# Altium project Drone.PrjPCB
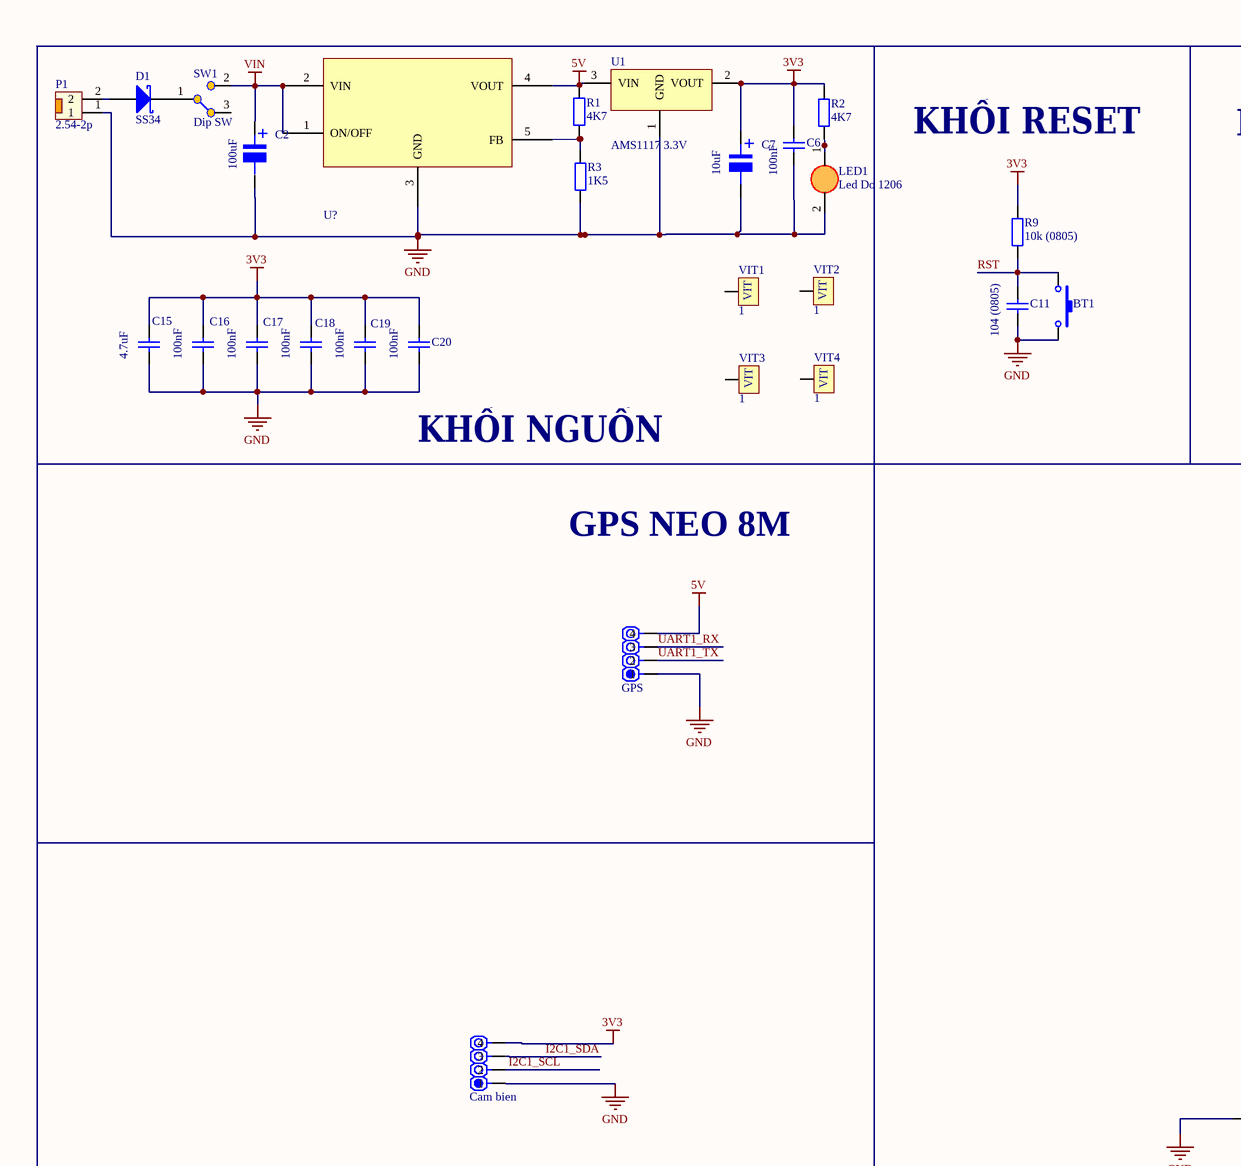
[diagram p0: Drone.SchDoc, top left]
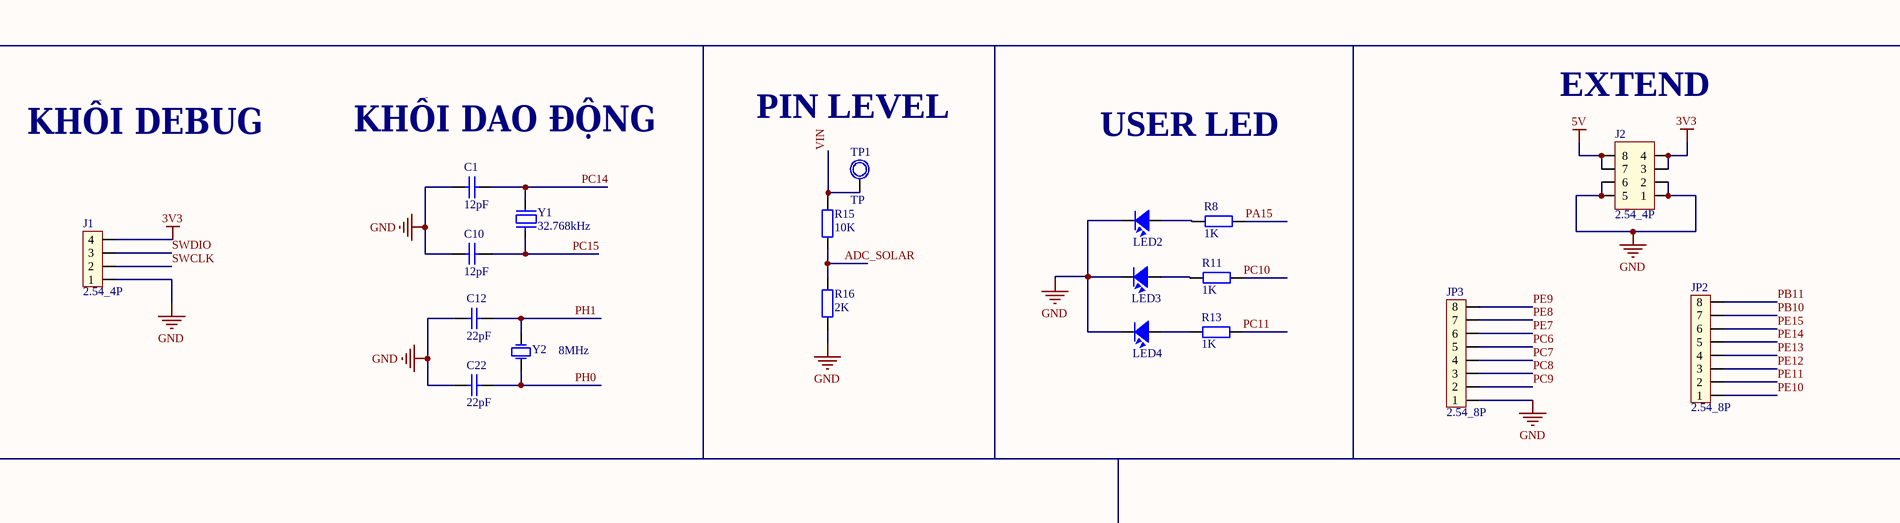
[diagram p1: Drone.SchDoc, top right]
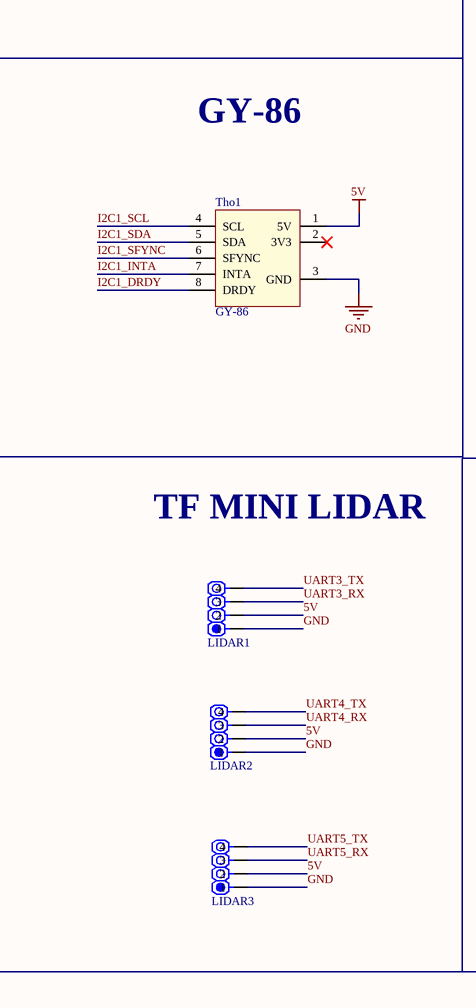
[diagram p2: Drone.SchDoc, bottom left]
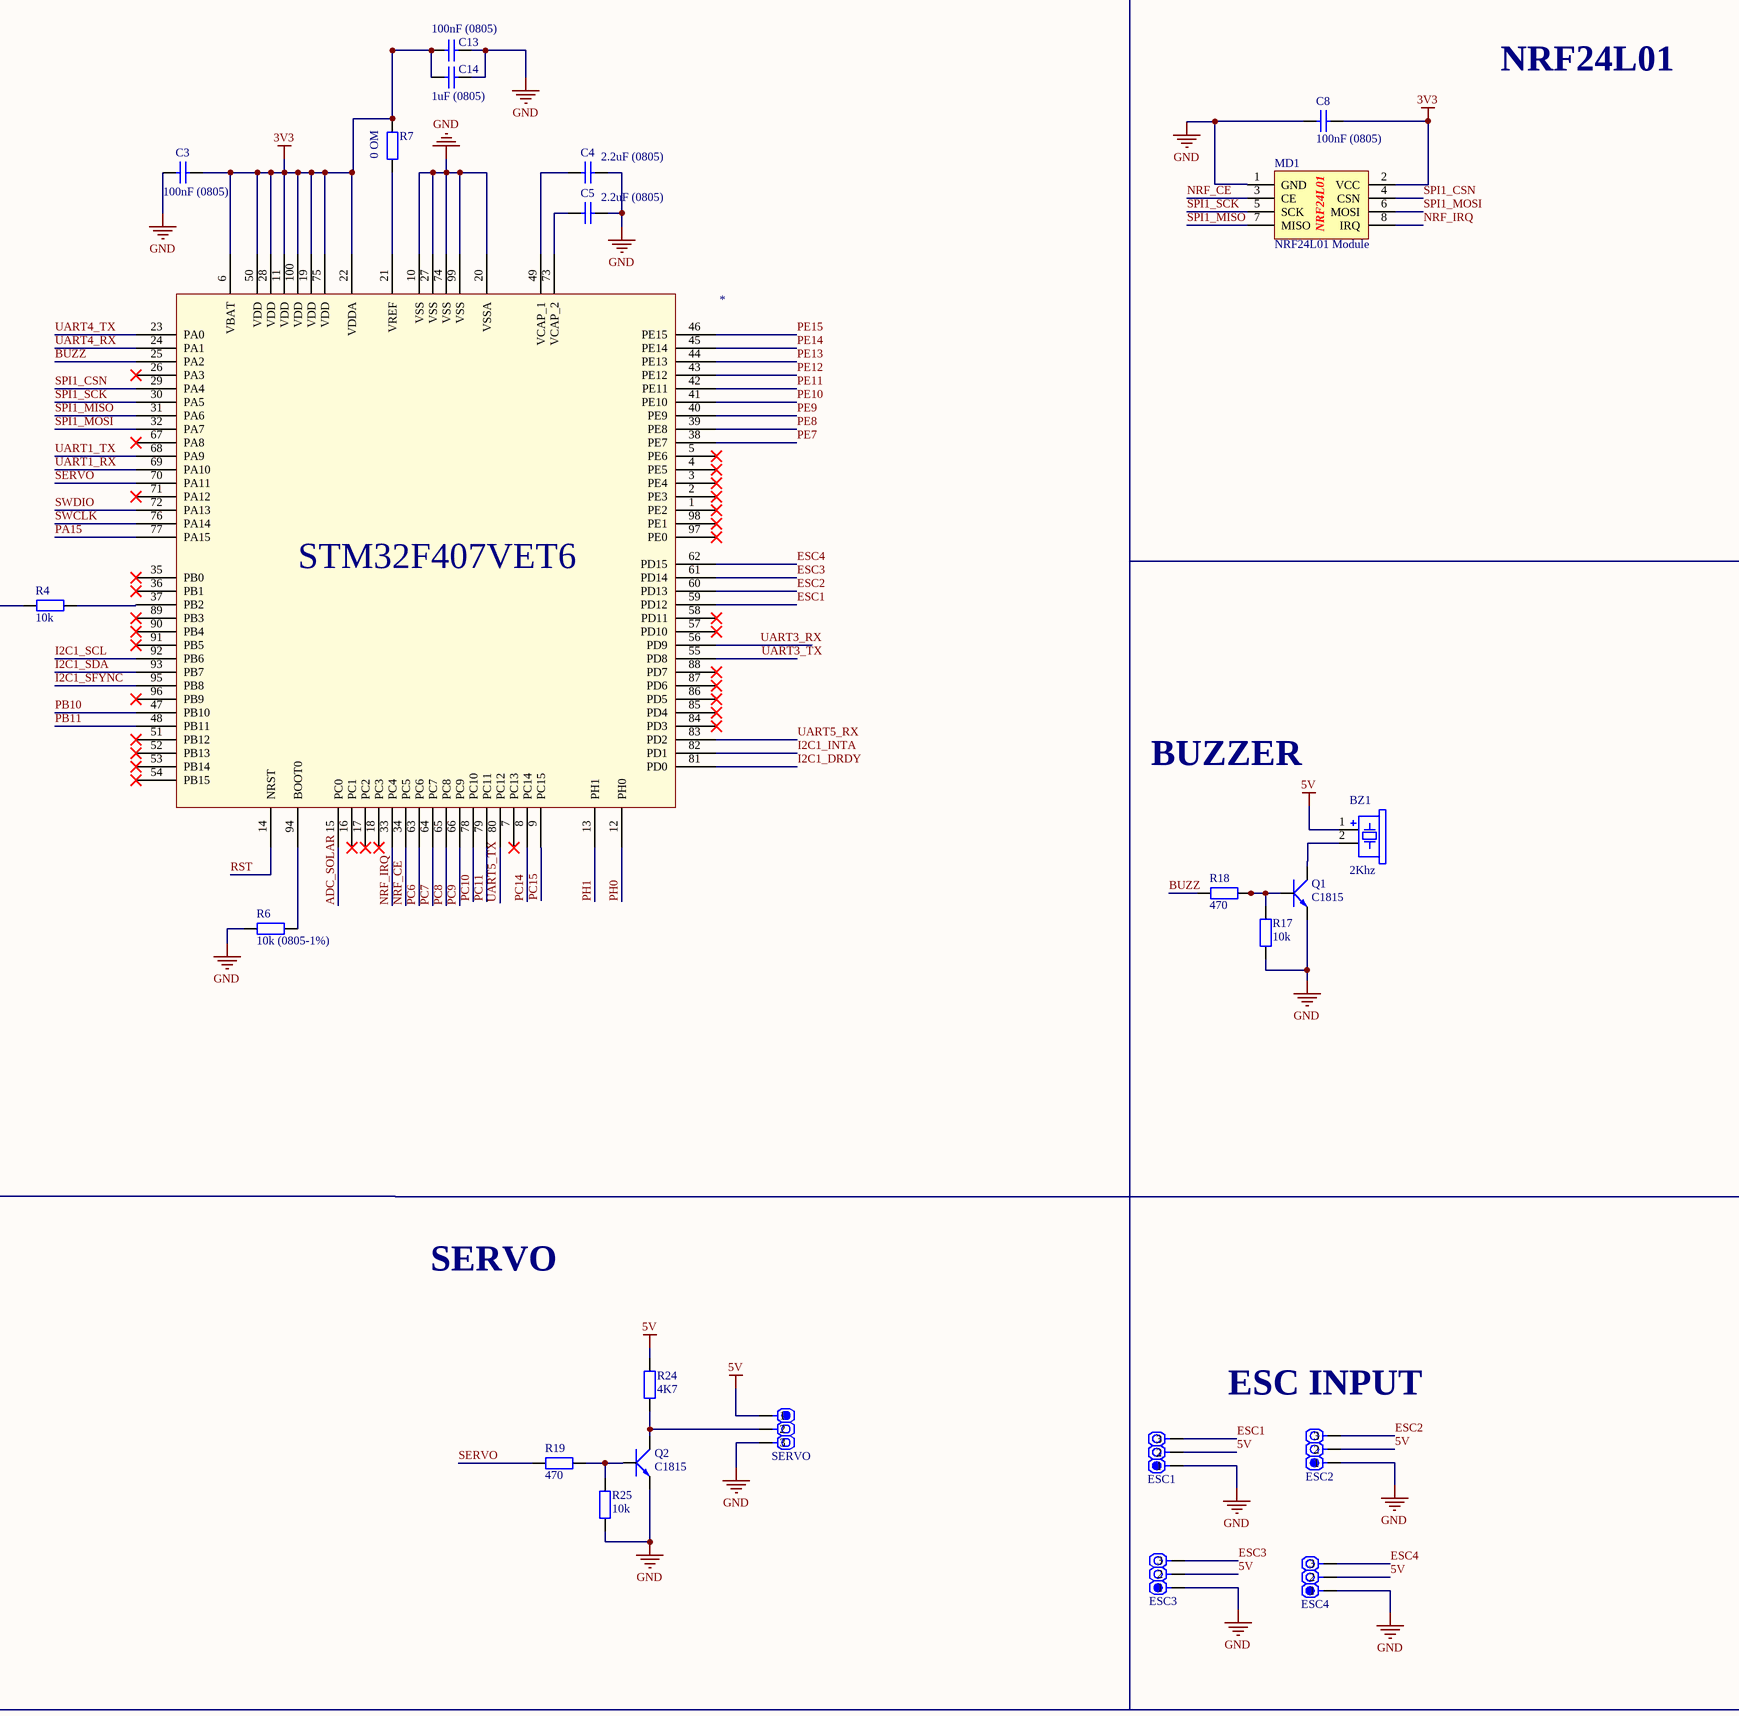
[diagram p3: Drone.SchDoc, bottom right]
1 sheet, 74 parts. Net scope: global (net labels, ports and power ports of the same name join across sheets).
Board file: DroneTHO.PcbDoc

## Sheet Drone.SchDoc
size 594 x 420 mm

### Parts
*  STM32F407  [STM32F407Vet6]  (value not drawn)
BT1  Nút Nhấn 2 Chân 3x6x2.5MM SMD  [Nut Nhan 2 Chan SMD_N]  (value not drawn)
BZ1  2Khz  [coi xung]
C1  12pF  [tu 0805]
C2  100uF  [tu nhom 10 (g)]
C3  100nF (0805)  [tu 0805]
C4  2.2uF (0805)  [tu 0805]
C5  2.2uF (0805)  [tu 0805]
C6  100nF  [tu 0805]
C7  10uF  [tu nhom 4 (b)]
C8  100nF (0805)  [tu 0805]
C10  12pF  [tu 0805]
C11  104 (0805)  [tu 0805]
C12  22pF  [tu 0805]
C13  100nF (0805)  [tu 0805]
C14  1uF (0805)  [tu 0805]
C15  4.7uF  [tu 0805]
C16  100nF  [tu 0805]
C17  100nF  [tu 0805]
C18  100nF  [tu 0805]
C19  100nF  [tu 0805]
C20  100nF  [tu 0805]
C22  22pF  [tu 0805]
Cam_bien  IO  [CON.HDR1X4L]  (value not drawn)
D1  SS34  [DIODE_DO214AC_SMA]
ESC1  IO  [CON.HDR1X3]  (value not drawn)
ESC2  IO  [CON.HDR1X3]  (value not drawn)
ESC3  IO  [CON.HDR1X3]  (value not drawn)
ESC4  IO  [CON.HDR1X3]  (value not drawn)
GPS  IO  [CON.HDR1X4L]  (value not drawn)
J1  2.54_4P  [jump don duc thang 2.54_4p]
J2  2.54_4P  [JP4x2]
JP2  2.54_8P  [Jump Don Duc Thang 2.54_8p]
JP3  2.54_8P  [Jump Don Duc Thang 2.54_8p]
LED1  Led Do 1206  [led 1206]
LED2  LED SMD  [SM-LED-0805-Yellow]  (value not drawn)
LED3  LED SMD  [SM-LED-0805-Green]  (value not drawn)
LED4  LED SMD  [SM-LED-0805-Blue]  (value not drawn)
LIDAR1  IO  [CON.HDR1X4L]  (value not drawn)
LIDAR2  IO  [CON.HDR1X4L]  (value not drawn)
LIDAR3  IO  [CON.HDR1X4L]  (value not drawn)
MD1  NRF24L01 Module  [NRF24L01]
MIC1  U?  [Mic5V]
P1  2.54-2p  [Header Duc Thang 2P 2.54]
Q1  C1815  [SOT23B]
Q2  C1815  [SOT23B]
R1  4K7  [tro 0805]
R2  4K7  [tro 0805]
R3  1K5  [tro 0805]
R4  10k  [tro 0805]
R6  10k (0805-1%)  [tro 0805]
R7  0 OM  [tro 0805]
R8  1K  [tro 0805]
R9  10k (0805)  [tro 0805]
R11  1K  [tro 0805]
R13  1K  [tro 0805]
R15  10K  [tro 0805]
R16  2K  [tro 0805]
R17  10k  [tro 0805]
R18  470  [tro 0805]
R19  470  [tro 0805]
R24  4K7  [tro 0805]
R25  10k  [tro 0805]
SERVO  IO  [CON.HDR1X3]  (value not drawn)
SW1  Dip SW  [SW3P]
Tho1  GY-86  [GY-86]
TP1  TP  [TP1]
U1  AMS1117 3.3V  [SOT223]
VIT1  1  [VIT]
VIT2  1  [VIT]
VIT3  1  [VIT]
VIT4  1  [VIT]
Y1  32.768kHz  [Thach Anh 2 Chan 32,768 KHz]
Y2  8MHz  [thach anh 49s smd]

### Nets
3V3: *.6(VBAT) *.11(VDD) *.19(VDD) *.22(VDDA) *.28(VDD) *.50(VDD) *.75(VDD) *.100(VDD) C3.1 C6.1 C7.1 C8.2 C13.2 C14.2 C15.1 C16.1 C17.1 C18.1 C19.1 C20.1 Cam_bien.4 J1.4 J2.3 J2.4 MD1.2(VCC) R2.1 R7.2 R9.2 U1.2(VOUT)
5V: BZ1.1 ESC1.2 ESC2.2 ESC3.2 ESC4.2 GPS.4 J2.7 J2.8 LIDAR1.2 LIDAR2.2 LIDAR3.2 MIC1.4(VOUT) R1.2 R24.2 SERVO.1 Tho1.1(5V) U1.3(VIN)
GND: *.10(VSS) *.20(VSSA) *.27(VSS) *.74(VSS) *.99(VSS) BT1.2 C1.2 C2.2 C3.2 C4.1 C5.1 C6.2 C7.2 C8.1 C10.2 C11.2 C12.2 C13.1 C14.1 C15.2 C16.2 C17.2 C18.2 C19.2 C20.2 C22.2 Cam_bien.1 ESC1.1 ESC2.1 ESC3.1 ESC4.1 GPS.1 J1.1 J2.1 J2.2 J2.5 J2.6 JP3.1 LED1.2(K) LED2.2 LED3.2 LED4.2 LIDAR1.1 LIDAR2.1 LIDAR3.1 MD1.1(GND) MIC1.3(GND) P1.1 Q1.1(E) Q2.1(E) R3.1 R4.1 R6.1 R16.1 R17.1 R25.1 SERVO.3 Tho1.3(GND) U1.1(GND)
VIN: C2.1 MIC1.1(ON/OFF) MIC1.2(VIN) R15.2 SW1.2(NC) TP1.1
ADC_SOLAR: *.15(PC0) R15.1 R16.2
BUZZ: *.25(PA2) R18.2
ESC1: *.59(PD12) ESC1.3
ESC2: *.60(PD13) ESC2.3
ESC3: *.61(PD14) ESC3.3
ESC4: *.62(PD15) ESC4.3
I2C1_DRDY: *.81(PD0) Tho1.8(DRDY)
I2C1_INTA: *.82(PD1) Tho1.7(INTA)
I2C1_SCL: *.92(PB6) Cam_bien.2 Tho1.4(SCL)
I2C1_SDA: *.93(PB7) Cam_bien.3 Tho1.5(SDA)
I2C1_SFYNC: *.95(PB8) Tho1.6(SFYNC)
NRF_CE: *.34(PC5) MD1.3(CE)
NRF_IRQ: *.33(PC4) MD1.8(IRQ)
PA15: *.77(PA15) R8.2
PB10: *.47(PB10) JP2.7
PB11: *.48(PB11) JP2.8
PC6: *.63(PC6) JP3.5
PC7: *.64(PC7) JP3.4
PC8: *.65(PC8) JP3.3
PC9: *.66(PC9) JP3.2
PC10: *.78(PC10) R11.2
PC11: *.79(PC11) R13.2
PC14: *.8(PC14) C1.1 Y1.2
PC15: *.9(PC15) C10.1 Y1.1
PE7: *.38(PE7) JP3.6
PE8: *.39(PE8) JP3.7
PE9: *.40(PE9) JP3.8
PE10: *.41(PE10) JP2.1
PE11: *.42(PE11) JP2.2
PE12: *.43(PE12) JP2.3
PE13: *.44(PE13) JP2.4
PE14: *.45(PE14) JP2.5
PE15: *.46(PE15) JP2.6
PH0: *.12(PH0) C22.1 Y2.2(OSC2)
PH1: *.13(PH1) C12.1 Y2.1(OSC1)
RST: *.14(NRST) BT1.1 C11.1 R9.1
SERVO: *.70(PA11) R19.2
SPI1_CSN: *.29(PA4) MD1.4(CSN)
SPI1_MISO: *.31(PA6) MD1.7(MISO)
SPI1_MOSI: *.32(PA7) MD1.6(MOSI)
SPI1_SCK: *.30(PA5) MD1.5(SCK)
SWCLK: *.76(PA14) J1.2
SWDIO: *.72(PA13) J1.3
UART1_RX: *.69(PA10) GPS.3
UART1_TX: *.68(PA9) GPS.2
UART3_RX: *.56(PD9) LIDAR1.3
UART3_TX: *.55(PD8) LIDAR1.4
UART4_RX: *.24(PA1) LIDAR2.3
UART4_TX: *.23(PA0) LIDAR2.4
UART5_RX: *.83(PD2) LIDAR3.3
UART5_TX: *.80(PC12) LIDAR3.4
Net*_21: *.21(VREF) R7.1
Net*_37: *.37(PB2) R4.2
Net*_49: *.49(VCAP_1) C4.2
Net*_73: *.73(VCAP_2) C5.2
Net*_94: *.94(BOOT0) R6.2
NetBZ1_2: BZ1.2 Q1.2(C)
NetD1_1: D1.1(A) P1.2
NetD1_2: D1.2(K) SW1.1(COM)
NetLED1_1: LED1.1(A) R2.2
NetLED2_1: LED2.1 R8.1
NetLED3_1: LED3.1 R11.1
NetLED4_1: LED4.1 R13.1
NetMIC1_5: MIC1.5(FB) R1.1 R3.2
NetQ1_3: Q1.3(B) R17.2 R18.1
NetQ2_2: Q2.2(C) R24.1 SERVO.2
NetQ2_3: Q2.3(B) R19.1 R25.2

Not connected (* = marked no-connect by the designer): * 1(PE2)* 2(PE3)* 3(PE4)* 4(PE5)* 5(PE6)* 7(PC13)* 16(PC1)* 17(PC2)* 18(PC3)* 26(PA3)* 35(PB0)* 36(PB1)* 51(PB12)* 52(PB13)* 53(PB14)* 54(PB15)* 57(PD10)* 58(PD11)* 67(PA8)* 71(PA12)* 84(PD3)* 85(PD4)* 86(PD5)* 87(PD6)* 88(PD7)* 89(PB3)* 90(PB4)* 91(PB5)* 96(PB9)* 97(PE0)* 98(PE1)*; SW1 3(NO); Tho1 2(3V3)*; VIT1 VIT1(1); VIT2 VIT1(1); VIT3 VIT1(1); VIT4 VIT1(1)

### Notes on the sheet
- KHỐI RESET
- KHỐI DEBUG
- KHỐI DAO ĐỘNG
- (near TP1) PIN LEVEL
- (near J2) EXTEND
- USER LED
- KHỐI NGUỒN
- GPS NEO 8M
- NRF24L01
- BUZZER
- GY-86
- TF MINI LIDAR
- SERVO
- (near ESC2) ESC INPUT
- (in symbol NRF24L01 Module) NRF24L01
- (in symbol STM32F407) STM32F407VET6
- (in symbol Tu Nhom 10uF 16V) +
- (in symbol Tu Nhom 100uF 35V) +

### Library data of the parts
BT1 = Nut Nhan 2 Chan SMD: Dán; Don_Vi: Con; So_Chan: 2; Ma_Hang: MH001036; Kieu_Chan: *; Ten_Linh_Kien: Nút Nhấn 2 Chân 3x6x2.5MM SMD; Chung_Loai: Dán
BZ1 = Coi xung 2Khz: Cắm; Don_Vi: Con; Ma_Hang: MH007704; Ten_Linh_Kien: Còi Xung 8.5x12MM 16R 2Khz 3-12V; Chung_Loai: Cắm
C1 C10 C12 C22 = Tu 0805 10pF 50V 10%: Dán; Don_Vi: Con; So_Chan: 2; Ten_Linh_Kien: Tụ 0805 10P 10% 50V; Ma_Hang: MH004554; Chung_Loai: Dán; Kieu_Chan: *
C2 = Tu Nhom 100uF 35V: Dán; Don_Vi: Con; Ten_Linh_Kien: Tụ Nhôm 100uF 35V; Ma_Hang: MH004019; So_Chan: 2; Chung_Loai: Dán; Kieu_Chan: *
C3-C6 C8 C13 C14 = Tu 0805 220nF 50V 10%: Dán; Don_Vi: Con; So_Chan: 2; Ten_Linh_Kien: Tụ 0805 220nF 50V 10%; Ma_Hang: MH008099; Chung_Loai: Dán; Kieu_Chan: *
C7 = Tu Nhom 10uF 16V: Dán; Don_Vi: Con; So_Chan: 2; Ten_Linh_Kien: Tụ Nhôm 10uF 16V 4x5MM; Ma_Hang: MH001458; Chung_Loai: Dán; Kieu_Chan: *
C11 C15-C20 = Tu 0805 104 50V 10%: Dán; Don_Vi: Con; So_Chan: 2; Ten_Linh_Kien: Tụ 0805 104-100nF 10% 50V; Ma_Hang: MH004551; Chung_Loai: Dán; Kieu_Chan: *
Cam_bien GPS LIDAR1-LIDAR3 = CON.HDR1x4: Header 1x4; Publisher: NKIM; ComponentLink1Description: Digikey Part link; ComponentLink2Description: Open DataSheet; ComponentLink2URL: H:\LIBRARY\LIBRARY.Datasheet\
D1 = SS34: DIODE SCHOTTKY 40V 3A SMA; Solder: SMT; MPN: SS34; Value: SS34; MFR: *
ESC1-ESC4 SERVO = CON.HDR1x3: Header 1x3; Publisher: NKIM; ComponentLink1Description: Digikey Part link; ComponentLink2Description: Open DataSheet; ComponentLink2URL: H:\LIBRARY\LIBRARY.Datasheet\
J1 = Jump Don Duc Thang 2.54_4P: Cắm; Don_Vi: Con; Ma_Hang: MH000903; So_Chan: 4; Ten_Linh_Kien: Jump Đơn Đực 2.54MM 1x40P Thẳng 11MM; Kieu Chan: *; Chung_Loai: Cắm
J2 = Jump Doi Duc 2.54_4Px2: Cắm; Ten_Linh_Kien: Jump Đơn Đực 2.54MM 1x40P Thẳng 11MM; Ma_Hang: MH000903; Don_Vi: Con; Ghi_Chu: *; Kieu_Chan: *; Chung_Loai: Cắm
JP2 JP3 = Jump Don Duc 2.54_8P: Cắm; Ten_Linh_Kien: Jump Đơn Đực 2.54MM 1x40P Thẳng 11MM; Ma_Hang: MH000903; Don_Vi: Con; Ghi_Chu: *; Kieu Chan: *; Chung_Loai: Cắm
LED1 = Led 1206 Do: Dán; Kieu_Chan: 1206; Ten_Linh_Kien: LED 1206 Màu Đỏ (Red); Ma_Hang: MH002334; Don_Vi: Con; So_Chan: 2; Chung_Loai: Dán
LED2-LED4 = LED-SMD-0805
MIC1 = Mic5V: 3A
P1 = Header 2.54-2p Duc Thang: Cắm; So_Chan: 2; Don_Vi: Con; Ten_Linh_Kien: Header 2P XH2.54-2P Đực Thẳng; Ma_Hang: MH001283; Chung_Loai: Cắm; Kieu_Chan: *
Q1 Q2 = C1815: NPN 600mW, ECB; Value: C1815
R1-R3 R7 R9 R15 R16 = Tro 0805 5% 10k: Dán; Don_Vi: Con; So_Chan: 2; Ten_Linh_Kien: Trở 0805 5% 10k; Ma_Hang: MH005239; Chung_Loai: Dán; Kieu_Chan: *
R4 R6 R17-R19 R24 R25 = Tro 0805 1% 10k: Dán; Don_Vi: Con; So_Chan: 2; Ten_Linh_Kien: Trở 0805 1% 10k; Ma_Hang: MH005473; Chung_Loai: Dán; Kieu_Chan: *
R8 R11 R13 = Tro 0805 5% 470R: Dán; Don_Vi: Con; Ma_Hang: MH005341; Ten_Linh_Kien: Trở 0805 5% 470R; So_Chan: 2; Chung_Loai: Dán; Kieu_Chan: *
SW1 = Switch3P: Dip Switch 3 pin
TP1 = TP1: Test Point; Value: Test Point
U1 = AMS1117 3.3V: Dán; Ten_Linh_Kien: AMS1117-3.3V SOT223; Don_Vi: Con; So_Chan: 4; Ma_Hang: MH000596; Kieu_Chan: SOT223; Chung_Loai: Dán
VIT1-VIT4 = VIT: Oc Vit
Y1 = Thach Anh 2 chan 32,768 Khz: Crystal For all Crystal 2pin.; Value: 4Mhz
Y2 = Thach anh 8MHz 49S SMD: Dán; Kieu_Chan: 49S SMD; Don_Vi: Con; So_Chan: 2; Ten_Linh_Kien: Thạch anh 8MHz 49S SMD; Ma_Hang: MH001985; Chung_Loai: Dán